# EAGLE design AeroQuad_v14 (EAGLE 5.06)
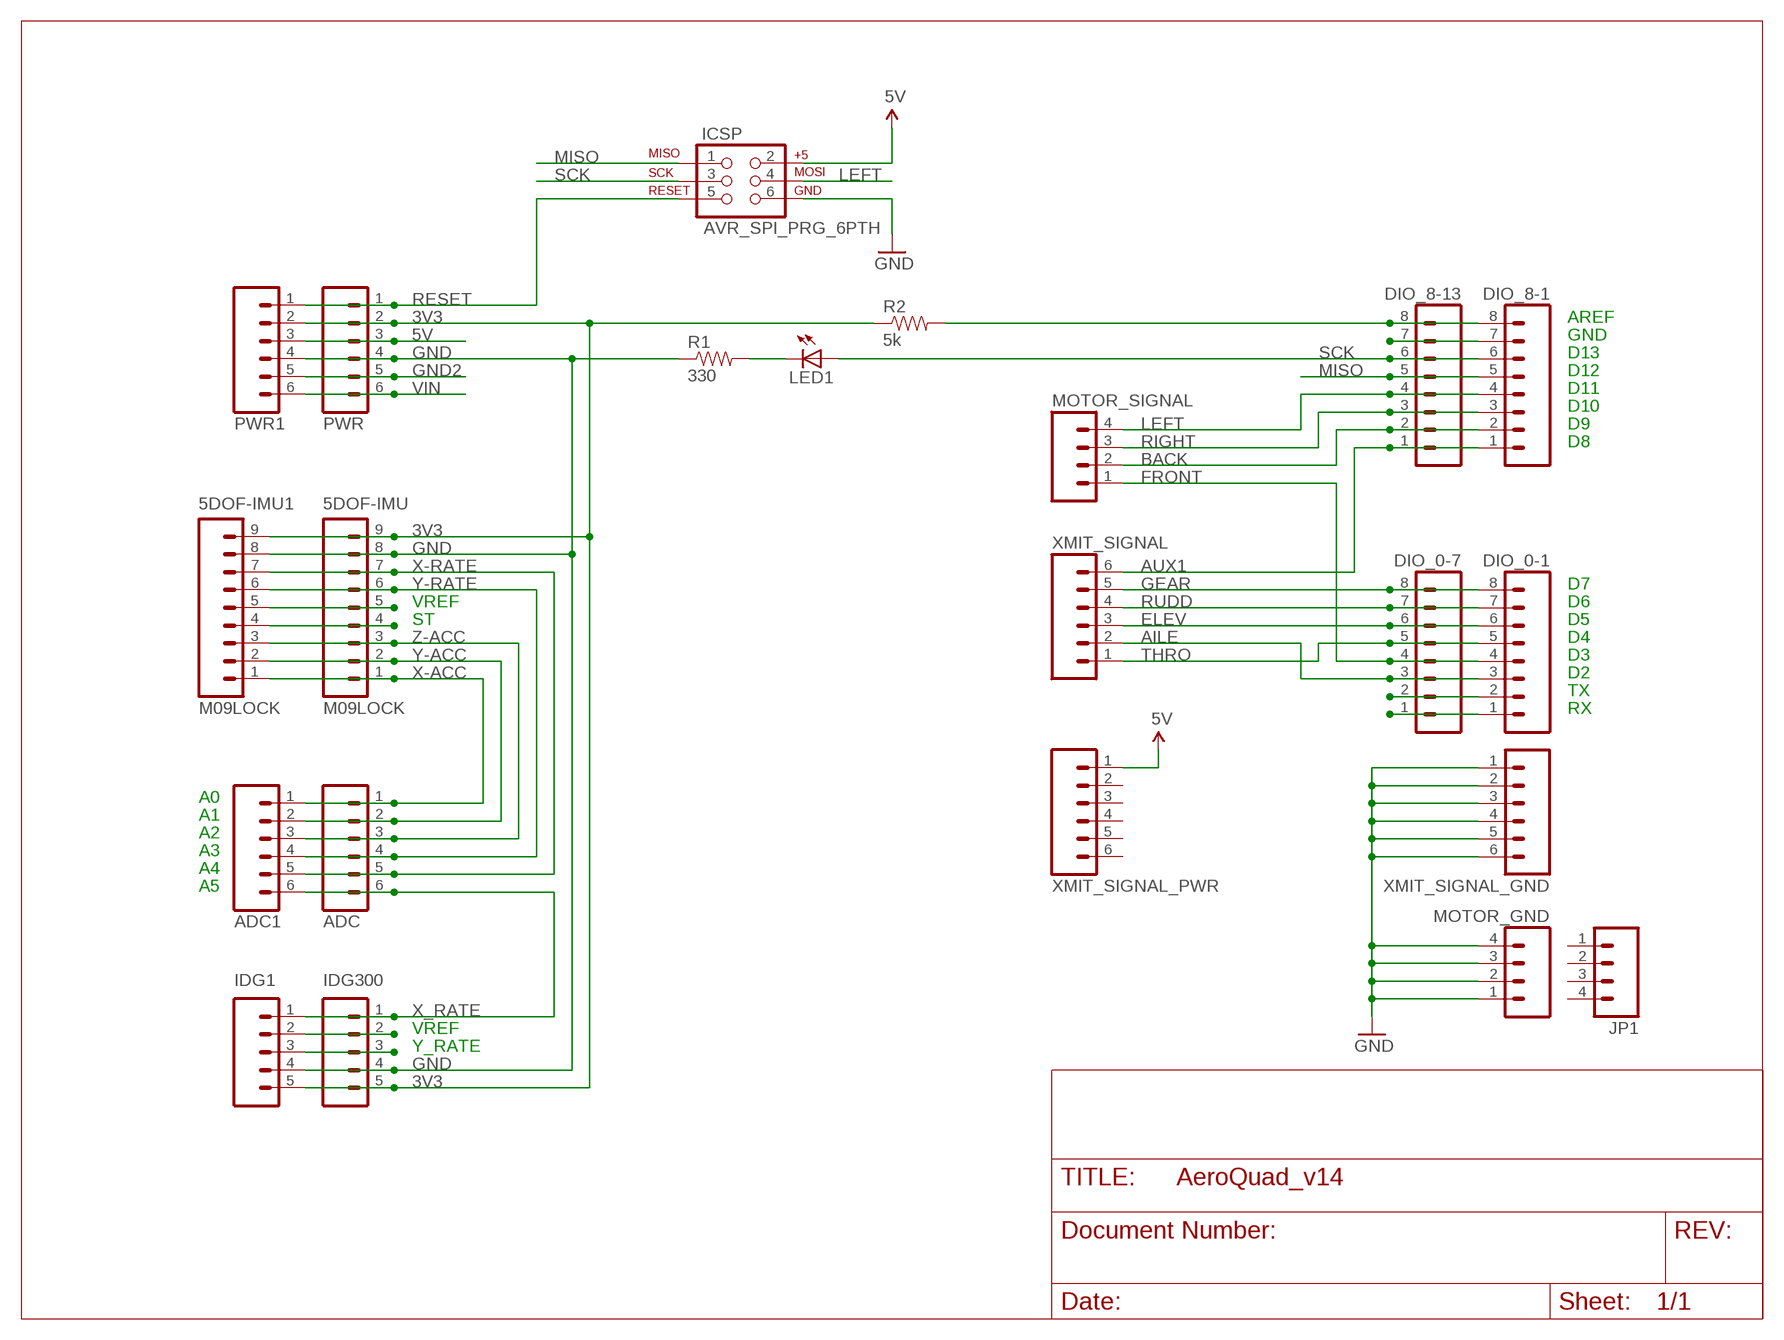
[diagram p0: schematic, sheet 1]

## Parts
5DOF-IMU  M09LOCK  [1X09_LOCK]
5DOF-IMU1  M09LOCK  [1X09_LOCK]
ADC  M06LOCK  [1X06_LOCK]
ADC1  M06LOCK  [1X06_LOCK]
DIO_0-1  M08LOCK  [1X08_LOCK]
DIO_0-7  M08LOCK  [1X08_LOCK]
DIO_8-1  M08LOCK  [1X08_LOCK]
DIO_8-13  M08LOCK  [1X08_LOCK]
ICSP  AVR_SPI_PRG_6PTH  [2X3]
IDG1  M05LOCK  [1X05_LOCK]
IDG300  M05LOCK  [1X05_LOCK]
JP1  M04LOCK  [1X04_LOCK]
LED1  LED5MM  [LED5MM]
MOTOR_GND  M04LOCK  [1X04_LOCK]
MOTOR_SIGNAL  M04LOCK  [1X04_LOCK]
PWR  M06LOCK  [1X06_LOCK]
PWR1  M06LOCK  [1X06_LOCK]
R1  330  RESISTORPTH1  [AXIAL-0.3]
R2  5k  RESISTORPTH1  [AXIAL-0.3]
XMIT_SIGNAL  M06LOCK  [1X06_LOCK]
XMIT_SIGNAL_GND  M06LOCK  [1X06_LOCK]
XMIT_SIGNAL_PWR  M06LOCK  [1X06_LOCK]

## Nets
3V3: 5DOF-IMU1.9 5DOF-IMU.9 IDG1.5 IDG300.5 PWR1.2 PWR.2 R2.P$1
5V: ICSP.2 PWR1.3 PWR.3 XMIT_SIGNAL_PWR.1
AILE: DIO_0-1.3 DIO_0-7.3 XMIT_SIGNAL.2
AREF: DIO_8-1.8 DIO_8-13.8 R2.P$2
AUX1: DIO_8-1.1 DIO_8-13.1 XMIT_SIGNAL.6
BACK: DIO_8-1.2 DIO_8-13.2 MOTOR_SIGNAL.2
ELEV: DIO_0-1.6 DIO_0-7.6 XMIT_SIGNAL.3
FRONT: DIO_0-1.4 DIO_0-7.4 MOTOR_SIGNAL.1
GEAR: DIO_0-1.8 DIO_0-7.8 XMIT_SIGNAL.5
GND: 5DOF-IMU1.8 5DOF-IMU.8 ICSP.6 IDG1.4 IDG300.4 MOTOR_GND.1 MOTOR_GND.2 MOTOR_GND.3 MOTOR_GND.4 PWR1.4 PWR.4 R1.P$1 XMIT_SIGNAL_GND.1 XMIT_SIGNAL_GND.2 XMIT_SIGNAL_GND.3 XMIT_SIGNAL_GND.4 XMIT_SIGNAL_GND.5 XMIT_SIGNAL_GND.6
GND2: PWR1.5 PWR.5
LEFT: DIO_8-1.4 DIO_8-13.4 ICSP.4 MOTOR_SIGNAL.4
MISO: DIO_8-1.5 DIO_8-13.5 ICSP.1
N$1: DIO_8-1.7 DIO_8-13.7
N$2: LED1.K(C) R1.P$2
N$3: DIO_0-1.2 DIO_0-7.2
N$4: DIO_0-1.1 DIO_0-7.1
N$9: 5DOF-IMU1.5 5DOF-IMU.5
N$11: 5DOF-IMU1.4 5DOF-IMU.4
N$12: IDG1.2 IDG300.2
N$13: IDG1.3 IDG300.3
RESET: ICSP.5 PWR1.1 PWR.1
RIGHT: DIO_8-1.3 DIO_8-13.3 MOTOR_SIGNAL.3
RUDD: DIO_0-1.7 DIO_0-7.7 XMIT_SIGNAL.4
SCK: DIO_8-1.6 DIO_8-13.6 ICSP.3 LED1.A
THRO: DIO_0-1.5 DIO_0-7.5 XMIT_SIGNAL.1
VIN: PWR1.6 PWR.6
X-ACC: 5DOF-IMU1.1 5DOF-IMU.1 ADC1.1 ADC.1
X-RATE: 5DOF-IMU1.7 5DOF-IMU.7 ADC1.5 ADC.5
X_RATE: ADC1.6 ADC.6 IDG1.1 IDG300.1
Y-ACC: 5DOF-IMU1.2 5DOF-IMU.2 ADC1.2 ADC.2
Y-RATE: 5DOF-IMU1.6 5DOF-IMU.6 ADC1.4 ADC.4
Z-ACC: 5DOF-IMU1.3 5DOF-IMU.3 ADC1.3 ADC.3
Unconnected: JP1.1 JP1.2 JP1.3 JP1.4 XMIT_SIGNAL_PWR.2 XMIT_SIGNAL_PWR.3 XMIT_SIGNAL_PWR.4 XMIT_SIGNAL_PWR.5 XMIT_SIGNAL_PWR.6

## Notes on the sheet
- AREF
- GND
- D13
- D12
- D11
- D10
- D9
- D8
- D7
- VREF | D6
- ST | D5
- D4
- D3
- D2
- TX
- RX
- A0
- A1
- A2
- A3
- A4
- A5
- VREF
- Y_RATE

## Library data of the parts
5DOF-IMU 5DOF-IMU1 = SparkFun:M09: Header 9 Standard 9-pin 0.1" header. Use with straight break away headers (SKU : PRT-00116), right angle break away headers (PRT-00553), swiss pins (PRT-00743), machine pins (PRT-00117), and female headers (PRT-00115).
ADC ADC1 PWR PWR1 XMIT_SIGNAL XMIT_SIGNAL_GND XMIT_SIGNAL_PWR = SparkFun:M06: Header 6 Standard 6-pin 0.1" header. Use with straight break away headers (SKU : PRT-00116), right angle break away headers (PRT-00553), swiss pins (PRT-00743), machine pins (PRT-00117), and female headers (PRT-00115). Molex polarized connector foot print use with SKU : PRT-08094 with associated crimp pins and housings. NOTES ON THE VARIANTS LOCK and LOCK_LONGPADS... This footprint was designed to help hold the alignment of a through-hole component (i.e. 6-pin header) while soldering it into place. You may notice that each hole has been shifted either up or down by 0.005 of an inch from it's more standard position (which is a perfectly straight line). This slight alteration caused the pins (the squares in the middle) to touch the edges of the holes. Because they are alternating, it causes a "brace" to hold the component in place. 0.005 has proven to be the perfect amount of "off-center" position when using our standard breakaway headers. Although looks a little odd when you look at the bare footprint, once you have a header in there, the alteration is very hard to notice. Also, if you push a header all the way into place, it is covered up entirely on the bottom side. This idea of altering the position of holes to aid alignment will be further integrated into the Sparkfun Library for other footprints. It can help hold any component with 3 or more connection pins.
DIO_0-1 DIO_0-7 DIO_8-1 DIO_8-13 = SparkFun:M08: Header 8 Standard 8-pin 0.1" header. Use with straight break away headers (SKU : PRT-00116), right angle break away headers (PRT-00553), swiss pins (PRT-00743), machine pins (PRT-00117), and female headers (PRT-00115).
ICSP = SparkFun:AVR_SPI_PRG_6: AVR ISP 6 Pin This is the reduced ISP connector for AVR programming. Common on Arduino. This footprint will take up less PCB space and can be used with a 10-pin to 6-pin adapter such as SKU: BOB-08508
IDG1 IDG300 = SparkFun:M05: Header 5 Standard 5-pin 0.1" header. Use with straight break away headers (SKU : PRT-00116), right angle break away headers (PRT-00553), swiss pins (PRT-00743), machine pins (PRT-00117), and female headers (PRT-00115). Molex polarized connector foot print use with SKU : PRT-08230 with associated crimp pins and housings.
JP1 MOTOR_GND MOTOR_SIGNAL = SparkFun:M04: Header 4 Standard 4-pin 0.1" header. Use with straight break away headers (SKU : PRT-00116), right angle break away headers (PRT-00553), swiss pins (PRT-00743), machine pins (PRT-00117), and female headers (PRT-00115). Molex polarized connector foot print use with SKU : PRT-08231 with associated crimp pins and housings.
LED1 = SparkFun:LED: LEDs Standard schematic elements and footprints for 5mm, 3mm, 1206, and 0603 sized LEDs. 5mm - Spark Fun Electronics SKU : COM-00529 (and others)
R1 R2 = SparkFun:RESISTOR: Resistor Basic schematic elements and footprints for 0603, 1206, and PTH 1/10th watt (small) resistors.

## Board
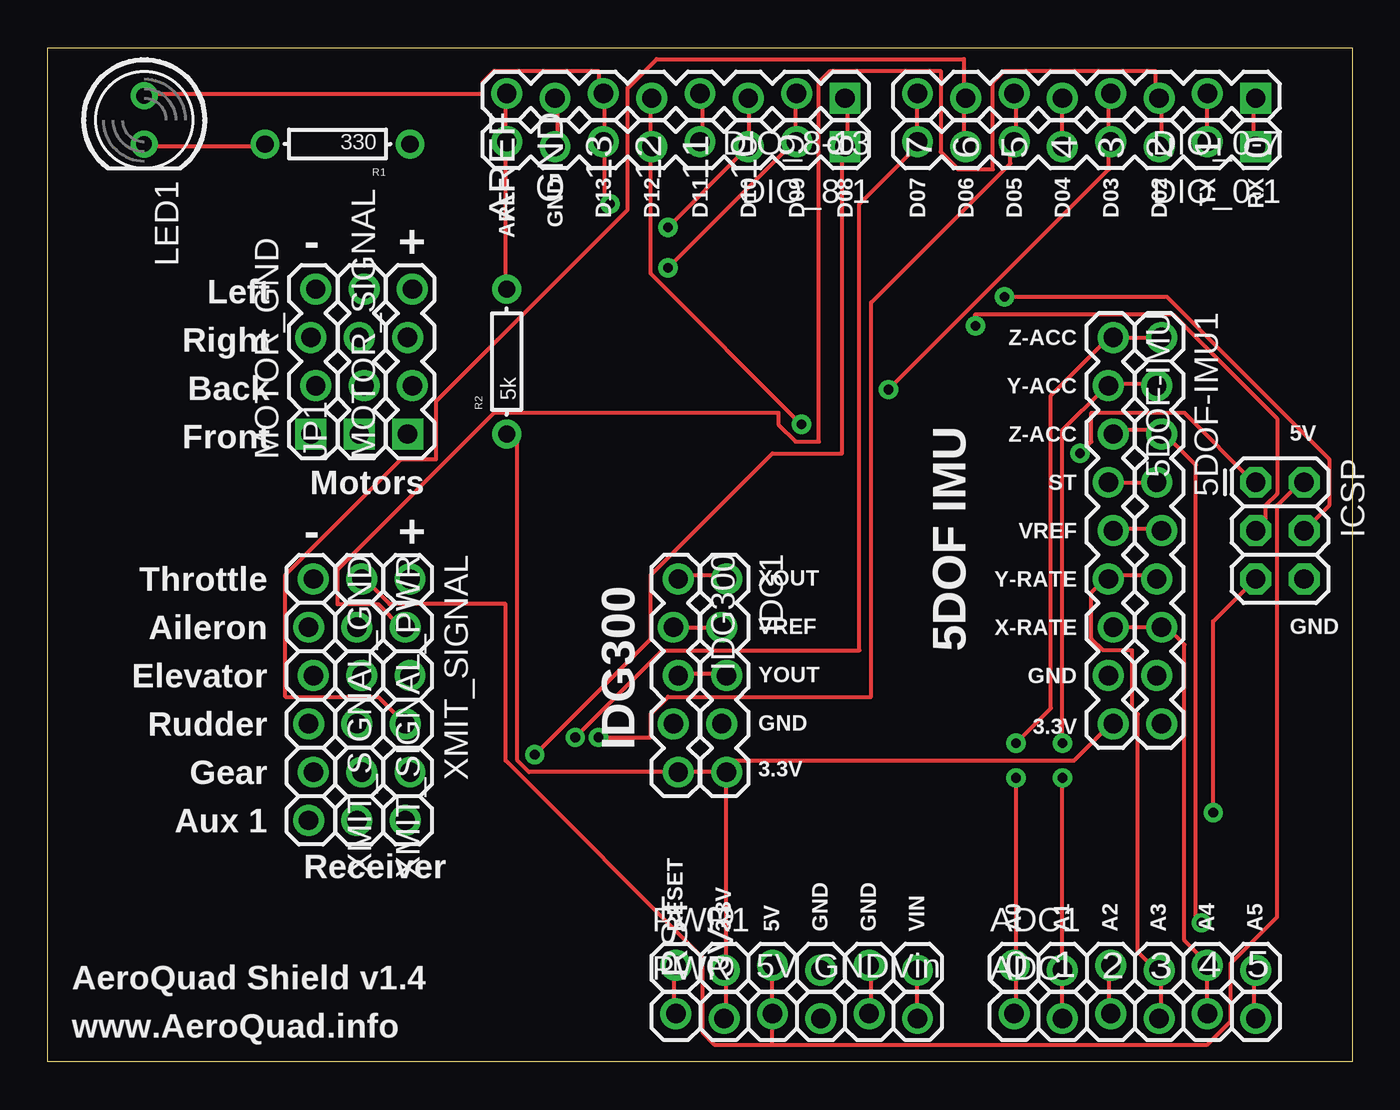
[diagram p1: board, top side]
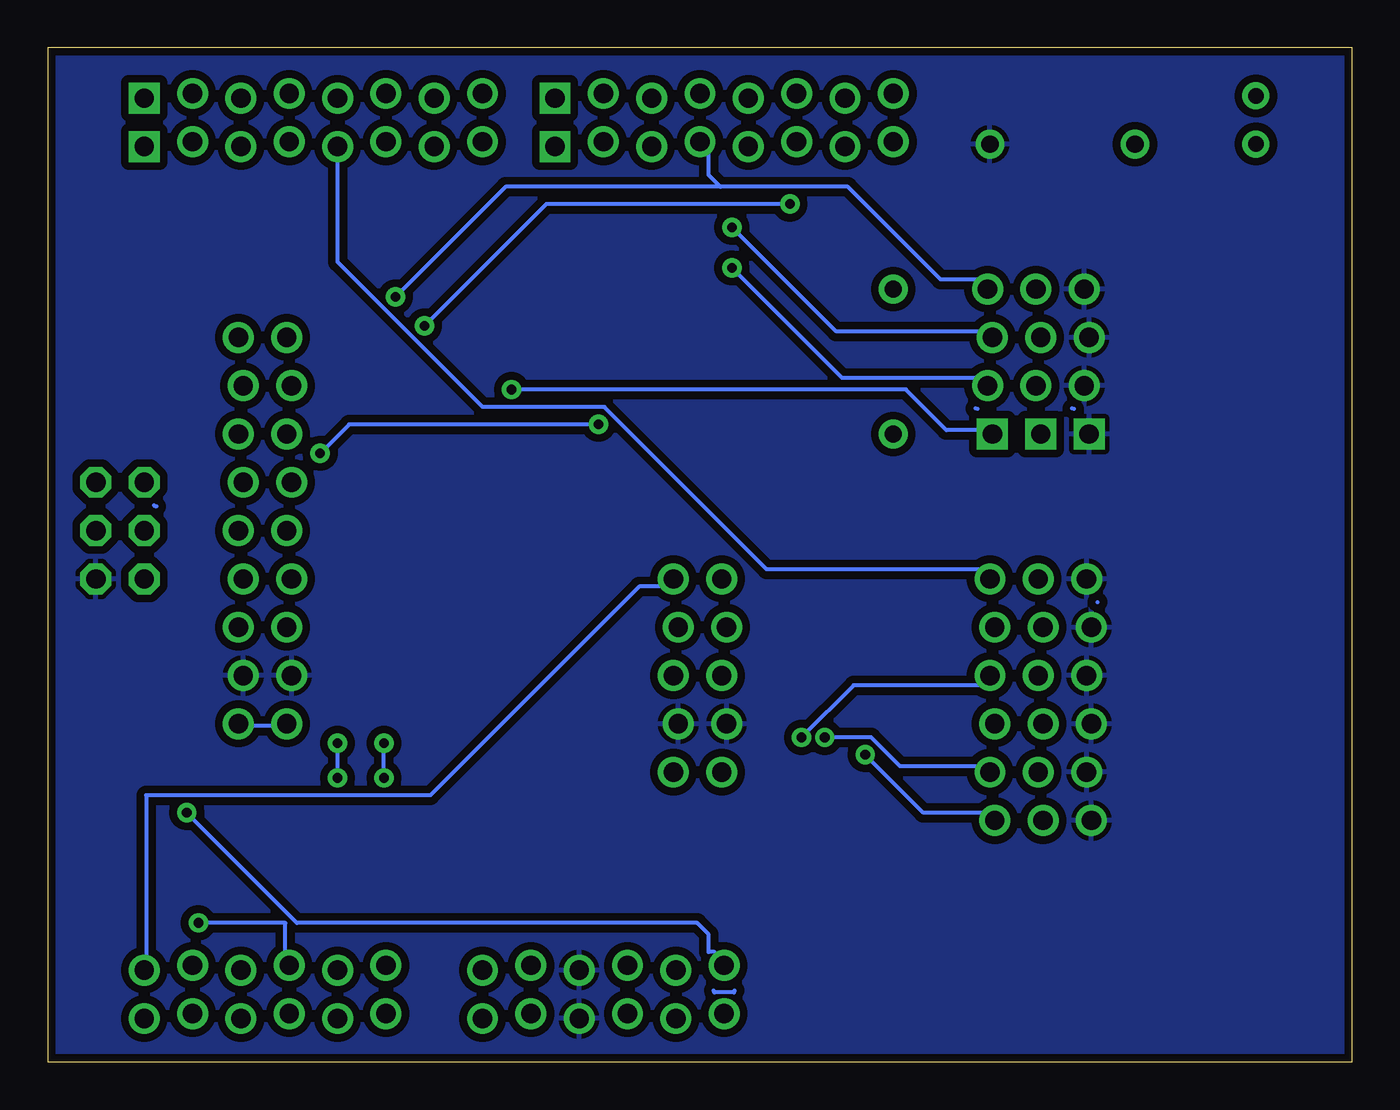
[diagram p2: board, bottom side, seen from below]

Size 68.58 x 53.34 mm. Coordinates in mm from the lower left corner, seen from the top.
Outline: 0,53.34 68.58,53.34 68.58,0 0,0 0,53.34
Copper layers (1*16): Top 0.035mm / dielectric 1.5mm / Bottom 0.035mm
Design rules "SparkFun": minimum track width 8mil, minimum drill 20mil, track to track 8mil, track to pad 8mil, pad to pad 8mil, via to via 8mil, smd to smd 8mil, copper to edge 10mil, drill to drill 8mil, minimum pad ring 12mil, minimum via ring 10mil, stop-mask expansion 4mil, vias tented up to drill 25mil, thermal gap 10mil

### Footprints (pad centres in the part's own frame; a part is rotated, then mirrored left to right if it is on the bottom)
1X09_LOCK = drill 1.016 round: 1 0,0.127; 2 2.54,-0.127; 3 5.08,0.127; 4 7.62,-0.127; 5 10.16,0.127; 6 12.7,-0.127; 7 15.24,0.127; 8 17.78,-0.127; 9 20.32,0.127
1X06_LOCK = drill 1.016 round: 1 0,0; 2 2.54,-0.254; 3 5.08,0; 4 7.62,-0.254; 5 10.16,0; 6 12.7,-0.254
1X08_LOCK = drill 1.016 square: 1 0,0.127 | drill 1.016 round: 2 2.54,-0.127; 3 5.08,0.127; 4 7.62,-0.127; 5 10.16,0.127; 6 12.7,-0.127; 7 15.24,0.127; 8 17.78,-0.127
2X3 = drill 1.016 octagon: 1 0,0; 2 0,2.54; 3 2.54,0; 4 2.54,2.54; 5 5.08,0; 6 5.08,2.54
1X05_LOCK = drill 1.016 round: 1 0,0.127; 2 2.54,-0.127; 3 5.08,0.127; 4 7.62,-0.127; 5 10.16,0.127
1X04_LOCK = drill 1.016 square: 1 0,0.127 | drill 1.016 round: 2 2.54,-0.127; 3 5.08,0.127; 4 7.62,-0.127
LED5MM = drill 0.813 round: A -1.27,0; K 1.27,0
AXIAL-0.3 = drill 0.9 round: P$1 -3.81,0; P$2 3.81,0

### Placement (x,y rotation side)
5DOF-IMU  55.88,38.1 270 top
5DOF-IMU1  58.42,38.1 270 top
ADC  50.8,2.54 0 top
ADC1  50.8,5.08 0 top
DIO_0-1  63.5,48.26 180 top
DIO_0-7  63.5,50.8 180 top
DIO_8-1  41.91,48.26 180 top
DIO_8-13  41.91,50.8 180 top
ICSP  63.5,30.48 270 top
IDG1  35.56,25.4 270 top
IDG300  33.02,25.4 270 top
JP1  16.51,33.02 90 top
LED1  5.08,49.53 270 top
MOTOR_GND  13.97,33.02 90 top
MOTOR_SIGNAL  19.05,33.02 90 top
PWR  33.02,2.54 0 top
PWR1  33.02,5.08 0 top
R1  15.24,48.26 180 top
R2  24.13,36.83 90 top
XMIT_SIGNAL  19.05,25.4 270 top
XMIT_SIGNAL_GND  13.97,25.4 270 top
XMIT_SIGNAL_PWR  16.51,25.4 270 top

### Tracks (layer width: path | path; a pad name or v marks a point on that pad's centre or on a via)
3V3
  Top 0.203: PWR.2 35.66,2.44 35.66,4.57 PWR1.2 35.66,4.88 35.66,15.24 | R2.P$1 24.38,32.92 24.69,32.61 24.69,15.85 25.3,15.24 IDG300.5 35.66,15.24 | 35.66,15.24 IDG1.5 35.97,15.24 35.97,15.85 53.95,15.85 55.78,17.68 5DOF-IMU.9
  Bottom 0.203: 5DOF-IMU.9 56.08,17.68 58.52,17.68 5DOF-IMU1.9
5V
  Top 0.203: PWR1.3 PWR.3 38.1,0.91 | 38.1,0.91 35.05,0.91 34.44,1.52 34.44,5.49 24.08,15.85 24.08,24.08 17.98,24.08 16.76,25.3 XMIT_SIGNAL_PWR.1 | 38.1,0.91 60.96,0.91 62.18,2.13 62.18,5.18 64.62,7.62 64.62,29.26 65.84,30.48 ICSP.2
AILE
  Top 0.203: XMIT_SIGNAL.2 18.59,22.86 17.37,24.08 15.24,24.08 15.24,25.91 23.47,34.14 38.41,34.14 38.41,33.53 39.32,32.61 40.54,32.61 40.54,51.51 41.15,52.12 46.94,52.12 46.94,47.85 47.85,46.94 49.68,46.94 49.68,51.51 50.29,52.12 58.22,52.12 58.22,50.9 DIO_0-7.3 58.52,50.6 58.52,48.16 DIO_0-1.3
AREF
  Top 0.203: R2.P$2 24.08,40.84 24.08,48.16 DIO_8-1.8 24.08,48.46 24.08,50.9 DIO_8-13.8
AUX1  (via drill 0.51)
  Top 0.203: v25.6,16.15 31.7,22.25 31.7,25.6 38.1,32 41.76,32 41.76,47.85 DIO_8-1.1 42.06,48.16 42.06,50.6 DIO_8-13.1
  Bottom 0.203: v25.6,16.15 22.55,13.11 19.2,13.11 XMIT_SIGNAL.6
BACK  (via drill 0.51)
  Top 0.203: v32.61,41.76 39.32,48.46 | 39.32,48.46 39.32,50.9 DIO_8-13.2 | 39.32,48.46 DIO_8-1.2
  Bottom 0.203: v32.61,41.76 26.82,35.97 19.51,35.97 19.2,35.66 MOTOR_SIGNAL.2
ELEV  (via drill 0.51)
  Top 0.203: v28.96,17.07 31.7,17.07 31.7,18.29 32.61,19.2 43.28,19.2 43.28,39.93 50.6,47.24 50.6,48.16 DIO_0-1.6 50.9,48.46 50.9,50.9 DIO_0-7.6
  Bottom 0.203: v28.96,17.07 26.21,19.81 19.51,19.81 19.2,20.12 XMIT_SIGNAL.3
FRONT  (via drill 0.51)
  Top 0.203: v44.2,35.36 55.78,46.94 55.78,48.16 DIO_0-1.4 55.78,48.46 55.78,50.9 DIO_0-7.4
  Bottom 0.203: v44.2,35.36 23.47,35.36 21.34,33.22 19.2,33.22 MOTOR_SIGNAL.1
GEAR  (via drill 0.51)
  Top 0.203: v27.74,17.07 32.31,21.64 42.67,21.64 42.67,45.11 45.72,48.16 DIO_0-1.8 DIO_0-7.8
  Bottom 0.203: v27.74,17.07 25.3,17.07 23.77,15.54 19.51,15.54 19.2,15.24 XMIT_SIGNAL.5
GND
  pour Bottom (isolate 0.406): 0,53.34 68.58,53.34 68.58,0 0,0
GND2
  Top 0.203: PWR.5 43.28,2.74 43.28,4.88 PWR1.5
LEFT  (via drill 0.51)
  Top 0.203: DIO_8-13.4 34.44,50.9 34.44,48.46 DIO_8-1.4 | v50.29,40.23 58.83,40.23 67.36,31.7 67.36,29.26 ICSP.4
  Bottom 0.203: 33.22,46.02 26.52,46.02 21.64,41.15 19.51,41.15 19.2,40.84 MOTOR_SIGNAL.4 | 33.22,46.02 33.83,46.63 33.83,48.16 34.14,48.16 DIO_8-1.4 | v50.29,40.23 44.5,46.02 33.22,46.02
MISO  (via drill 0.51)
  Top 0.203: DIO_8-13.5 31.7,50.6 31.7,48.16 DIO_8-1.5 31.7,47.85 31.7,41.45 v39.62,33.53 | v54.25,32 54.86,32.61 54.86,34.14 59.74,34.14 63.4,30.48 ICSP.1
  Bottom 0.203: v54.25,32 52.73,33.53 v39.62,33.53
N$1
  Top 0.203: DIO_8-1.7 26.82,48.16 26.82,50.6 DIO_8-13.7
N$2
  Top 0.203: LED1.K 5.18,48.16 11.28,48.16 R1.P$2
N$3
  Top 0.203: DIO_0-1.2 DIO_0-7.2
N$4
  Top 0.203: DIO_0-1.1 63.4,48.16 63.4,50.6 DIO_0-7.1
N$5
  Bottom 0.203: 62.99,29.26 62.87,29.21
N$7
  Bottom 0.203: 19.71,34.34 19.81,34.37
N$8
  Bottom 0.203: 13.41,24.18 13.39,24.18
N$9
  Top 0.203: 5DOF-IMU.5 56.08,28.04 58.52,28.04 5DOF-IMU1.5
N$10
  Bottom 0.203: 14.63,34.34 14.73,34.37
N$11
  Top 0.203: 5DOF-IMU.4 5DOF-IMU1.4
N$12
  Top 0.203: IDG300.2 IDG1.2
N$13
  Top 0.203: IDG300.3 33.22,20.42 35.66,20.42 IDG1.3
N$14
  Bottom 0.203: 32.47,3.77 32.51,3.66 33.53,3.66 33.57,3.77
RESET  (via drill 0.51)
  Top 0.203: PWR.1 32.92,2.74 32.92,4.88 PWR1.1 | v61.27,13.11 61.27,23.16 ICSP.5
  Bottom 0.203: v61.27,13.11 55.47,7.32 34.44,7.32 33.83,6.71 33.83,5.79 33.53,5.79 32.92,5.18 PWR1.1
RIGHT  (via drill 0.51)
  Top 0.203: v32.61,43.89 36.58,47.85 DIO_8-1.3 36.88,48.16 36.88,50.6 DIO_8-13.3
  Bottom 0.203: v32.61,43.89 27.13,38.41 19.51,38.41 19.2,38.1 MOTOR_SIGNAL.3
RUDD
  Top 0.203: XMIT_SIGNAL.4 17.37,19.2 12.5,19.2 12.5,25.6 18.59,31.7 20.42,31.7 20.42,34.75 30.48,44.81 30.48,51.21 32,52.73 48.16,52.73 48.16,50.9 DIO_0-7.7 48.16,50.6 48.16,48.16 DIO_0-1.7
SCK  (via drill 0.51)
  Top 0.203: LED1.A 5.18,50.9 22.86,50.9 22.86,51.51 23.47,52.12 28.96,52.12 28.96,51.21 DIO_8-13.6 29.26,50.9 29.26,48.46 DIO_8-1.6 29.26,48.16 29.26,45.41 v29.57,45.11 | v48.77,38.71 48.77,39.32 59.13,39.32 64.62,33.83 64.62,29.87 64.01,29.26 64.01,28.35 63.7,28.04 ICSP.3
  Bottom 0.203: v48.77,38.71 42.37,45.11 v29.57,45.11
THRO
  Top 0.203: DIO_0-1.5 DIO_0-7.5
  Bottom 0.203: XMIT_SIGNAL.1 19.2,25.6 19.51,25.91 30.79,25.91 39.32,34.44 45.72,34.44 53.34,42.06 DIO_0-1.5
VIN
  Top 0.203: PWR.6 PWR1.6
X-ACC  (via drill 0.51)
  Top 0.203: ADC.1 50.9,2.74 50.9,4.88 ADC1.1 50.9,5.18 v50.9,14.94 | 5DOF-IMU1.1 5DOF-IMU.1 55.78,38.1 52.73,35.05 52.73,18.59 v50.9,16.76
  Bottom 0.203: v50.9,14.94 v50.9,16.76
X-RATE
  Top 0.203: 5DOF-IMU.7 5DOF-IMU1.7 58.83,22.86 59.74,21.95 59.74,6.4 60.96,5.18 ADC1.5 ADC.5
X_RATE
  Top 0.203: ADC.6 63.4,2.44 63.4,4.57 ADC1.6 | IDG300.1 33.22,25.6 35.66,25.6 IDG1.1
  Bottom 0.203: ADC1.6 63.4,4.88 63.4,14.02 48.46,14.02 37.49,24.99 36.27,24.99 35.97,25.3 IDG1.1
Y-ACC  (via drill 0.51)
  Top 0.203: ADC.2 ADC1.2 v53.34,14.94 | 5DOF-IMU1.2 58.22,35.66 55.78,35.66 5DOF-IMU.2 55.47,35.36 53.34,33.22 v53.34,16.76
  Bottom 0.203: v53.34,14.94 v53.34,16.76
Y-RATE
  Top 0.203: 5DOF-IMU1.6 58.22,25.6 55.78,25.6 5DOF-IMU.6 55.47,25.3 54.86,24.69 54.86,22.25 55.47,21.64 57,21.64 57,18.59 57.3,18.29 57.3,5.79 58.22,4.88 ADC1.4 58.52,4.57 58.52,2.44 ADC.4
Z-ACC  (via drill 0.51)
  Top 0.203: ADC.3 55.78,2.74 55.78,4.88 ADC1.3 | 5DOF-IMU.3 56.08,33.22 58.52,33.22 5DOF-IMU1.3 58.83,32.92 60.35,31.39 60.35,7.62 v60.66,7.32
  Bottom 0.203: v60.66,7.32 56.08,7.32 56.08,5.18 ADC1.3

### Text on the board
tPlace: AREF | GND | D13 | D12 | D11 | D10 | D09 | D08 | D07 | D06 | D05 | D04 | D03 | D02 | TX | RX | - | + | Left | Right | Z-ACC | Back | Y-ACC | Front | Z-ACC | 5V | Motors | ST | VREF | - | + | Throttle | Y-RATE | IDG300 | XOUT | Aileron | X-RATE | VREF | 5DOF IMU | GND | Elevator | GND | YOUT | Rudder | 3.3V | GND | Gear | 3.3V | Aux 1 | Receiver | RESET | 3.3V | 5V | GND | GND | VIN | A0 | A1 | A2 | A3 | A4 | A5 | AeroQuad Shield v1.4 | www.AeroQuad.info
tNames: 9 | 8 | 7 | 6 | 5 | 4 | 3 | 2 | 1 | 0 | 13 | 12 | 11 | 10 | GND | AREF | RST | 3V3 | 5V | GND | Vin | 0 | 1 | 2 | 3 | 4 | 5